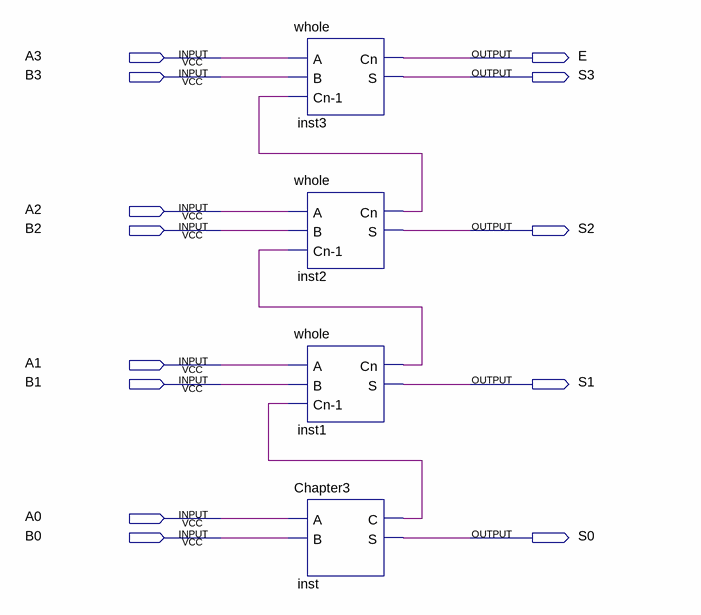
[diagram p0: schematic sheet]
// Quartus schematic 4bit_sum.bdf as structural Verilog: 4 symbols, 13 pins
module \4bit_sum  (
  input  A3,
  input  B3,
  input  A2,
  input  B2,
  input  A1,
  input  B1,
  input  A0,
  input  B0,
  output E,
  output S3,
  output S2,
  output S1,
  output S0
);

  wire inst1_cn, inst2_cn, inst_c;

  whole inst3 (.A(A3), .B(B3), .\Cn-1 (inst2_cn), .Cn(E), .S(S3));
  whole inst2 (.A(A2), .B(B2), .\Cn-1 (inst1_cn), .Cn(inst2_cn), .S(S2));
  whole inst1 (.A(A1), .B(B1), .\Cn-1 (inst_c), .Cn(inst1_cn), .S(S1));
  Chapter3 inst (.A(A0), .B(B0), .C(inst_c), .S(S0));
endmodule
